# Altium schematic sheet Debug_Port.SchDoc
size A4; SheetNumber: 9; SheetTotal: 9
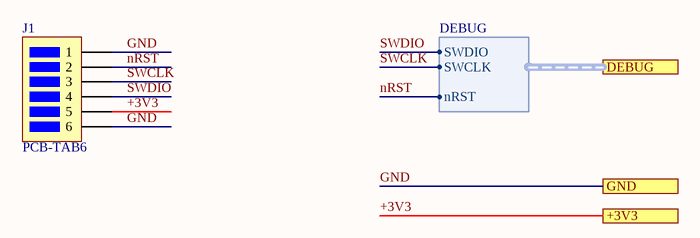
[diagram p0: Debug_Port.SchDoc]

## Parts
J1  PCB-TAB6  [PCB-TAB6]

## Ports
+3V3, DEBUG (harness DEBUG), GND

## Harnesses
DEBUG: nRST, SWCLK, SWDIO

## Nets
+3V3: J1.5 ; port +3V3
GND: J1.1 J1.6 ; port GND
nRST: J1.2 ; port DEBUG.nRST
SWCLK: J1.3 ; port DEBUG.SWCLK
SWDIO: J1.4 ; port DEBUG.SWDIO